# EAGLE design lcmxo256c_bb (EAGLE 7.3.0)
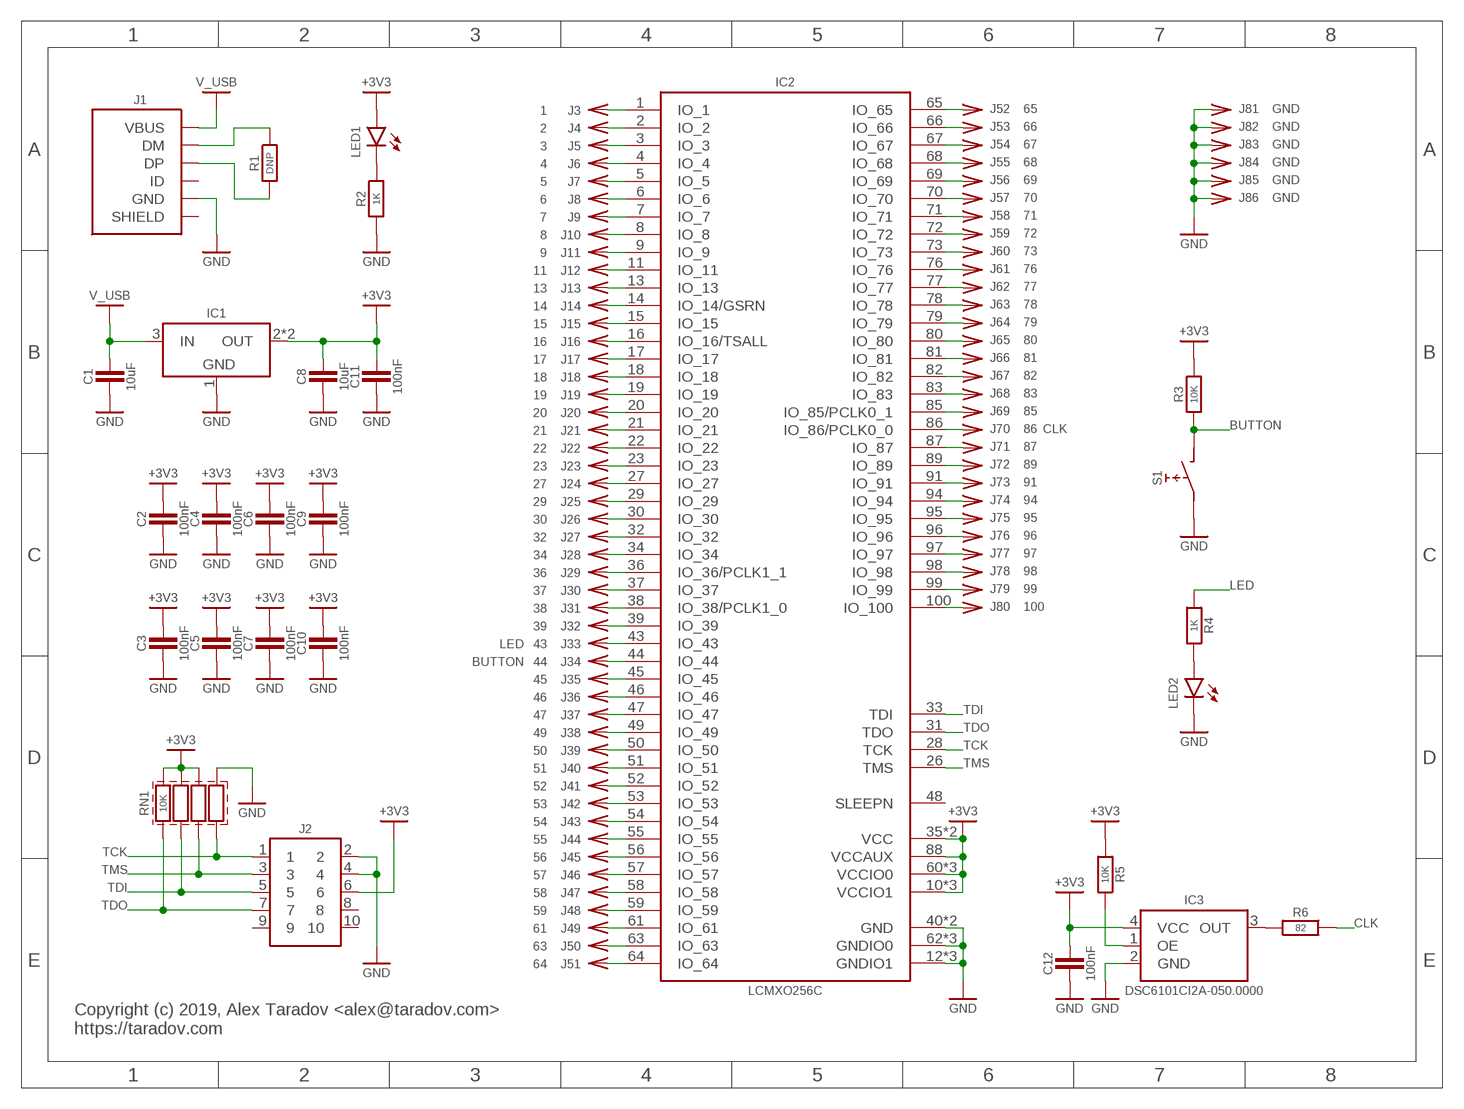
[diagram p0: schematic, sheet 1]

## Parts
C1  10uF  C-0805  [SMD0805]
C2  100nF  C-0603  [SMD0603]
C3  100nF  C-0603  [SMD0603]
C4  100nF  C-0603  [SMD0603]
C5  100nF  C-0603  [SMD0603]
C6  100nF  C-0603  [SMD0603]
C7  100nF  C-0603  [SMD0603]
C8  10uF  C-0805  [SMD0805]
C9  100nF  C-0603  [SMD0603]
C10  100nF  C-0603  [SMD0603]
C11  100nF  C-0603  [SMD0603]
C12  100nF  C-0603  [SMD0603]
IC1  LM1117-SOT223  [SOT223]
IC2  LCMXO256C  LCMXO256C-100  [TQFP-100-0.5MM]
IC3  DSC6101CI2A-050.0000  OSC_EN-CDFN4  [CDFN4]
J1  USB-B-MICRO-SMT  [USB-B-MICRO-SMT-SHELL-TH]
J2  HEADER-5X2-TH-1.27  [HEADER-5X2-1.27MM]
J3  1  CONN-SINGLE-TH  [PIN-TH]
J4  2  CONN-SINGLE-TH  [PIN-TH]
J5  3  CONN-SINGLE-TH  [PIN-TH]
J6  4  CONN-SINGLE-TH  [PIN-TH]
J7  5  CONN-SINGLE-TH  [PIN-TH]
J8  6  CONN-SINGLE-TH  [PIN-TH]
J9  7  CONN-SINGLE-TH  [PIN-TH]
J10  8  CONN-SINGLE-TH  [PIN-TH]
J11  9  CONN-SINGLE-TH  [PIN-TH]
J12  11  CONN-SINGLE-TH  [PIN-TH]
J13  13  CONN-SINGLE-TH  [PIN-TH]
J14  14  CONN-SINGLE-TH  [PIN-TH]
J15  15  CONN-SINGLE-TH  [PIN-TH]
J16  16  CONN-SINGLE-TH  [PIN-TH]
J17  17  CONN-SINGLE-TH  [PIN-TH]
J18  18  CONN-SINGLE-TH  [PIN-TH]
J19  19  CONN-SINGLE-TH  [PIN-TH]
J20  20  CONN-SINGLE-TH  [PIN-TH]
J21  21  CONN-SINGLE-TH  [PIN-TH]
J22  22  CONN-SINGLE-TH  [PIN-TH]
J23  23  CONN-SINGLE-TH  [PIN-TH]
J24  27  CONN-SINGLE-TH  [PIN-TH]
J25  29  CONN-SINGLE-TH  [PIN-TH]
J26  30  CONN-SINGLE-TH  [PIN-TH]
J27  32  CONN-SINGLE-TH  [PIN-TH]
J28  34  CONN-SINGLE-TH  [PIN-TH]
J29  36  CONN-SINGLE-TH  [PIN-TH]
J30  37  CONN-SINGLE-TH  [PIN-TH]
J31  38  CONN-SINGLE-TH  [PIN-TH]
J32  39  CONN-SINGLE-TH  [PIN-TH]
J33  43  CONN-SINGLE-TH  [PIN-TH]
J34  44  CONN-SINGLE-TH  [PIN-TH]
J35  45  CONN-SINGLE-TH  [PIN-TH]
J36  46  CONN-SINGLE-TH  [PIN-TH]
J37  47  CONN-SINGLE-TH  [PIN-TH]
J38  49  CONN-SINGLE-TH  [PIN-TH]
J39  50  CONN-SINGLE-TH  [PIN-TH]
J40  51  CONN-SINGLE-TH  [PIN-TH]
J41  52  CONN-SINGLE-TH  [PIN-TH]
J42  53  CONN-SINGLE-TH  [PIN-TH]
J43  54  CONN-SINGLE-TH  [PIN-TH]
J44  55  CONN-SINGLE-TH  [PIN-TH]
J45  56  CONN-SINGLE-TH  [PIN-TH]
J46  57  CONN-SINGLE-TH  [PIN-TH]
J47  58  CONN-SINGLE-TH  [PIN-TH]
J48  59  CONN-SINGLE-TH  [PIN-TH]
J49  61  CONN-SINGLE-TH  [PIN-TH]
J50  63  CONN-SINGLE-TH  [PIN-TH]
J51  64  CONN-SINGLE-TH  [PIN-TH]
J52  65  CONN-SINGLE-TH  [PIN-TH]
J53  66  CONN-SINGLE-TH  [PIN-TH]
J54  67  CONN-SINGLE-TH  [PIN-TH]
J55  68  CONN-SINGLE-TH  [PIN-TH]
J56  69  CONN-SINGLE-TH  [PIN-TH]
J57  70  CONN-SINGLE-TH  [PIN-TH]
J58  71  CONN-SINGLE-TH  [PIN-TH]
J59  72  CONN-SINGLE-TH  [PIN-TH]
J60  73  CONN-SINGLE-TH  [PIN-TH]
J61  76  CONN-SINGLE-TH  [PIN-TH]
J62  77  CONN-SINGLE-TH  [PIN-TH]
J63  78  CONN-SINGLE-TH  [PIN-TH]
J64  79  CONN-SINGLE-TH  [PIN-TH]
J65  80  CONN-SINGLE-TH  [PIN-TH]
J66  81  CONN-SINGLE-TH  [PIN-TH]
J67  82  CONN-SINGLE-TH  [PIN-TH]
J68  83  CONN-SINGLE-TH  [PIN-TH]
J69  85  CONN-SINGLE-TH  [PIN-TH]
J70  86  CONN-SINGLE-TH  [PIN-TH]
J71  87  CONN-SINGLE-TH  [PIN-TH]
J72  89  CONN-SINGLE-TH  [PIN-TH]
J73  91  CONN-SINGLE-TH  [PIN-TH]
J74  94  CONN-SINGLE-TH  [PIN-TH]
J75  95  CONN-SINGLE-TH  [PIN-TH]
J76  96  CONN-SINGLE-TH  [PIN-TH]
J77  97  CONN-SINGLE-TH  [PIN-TH]
J78  98  CONN-SINGLE-TH  [PIN-TH]
J79  99  CONN-SINGLE-TH  [PIN-TH]
J80  100  CONN-SINGLE-TH  [PIN-TH]
J81  GND  CONN-SINGLE-TH  [PIN-TH]
J82  GND  CONN-SINGLE-TH  [PIN-TH]
J83  GND  CONN-SINGLE-TH  [PIN-TH]
J84  GND  CONN-SINGLE-TH  [PIN-TH]
J85  GND  CONN-SINGLE-TH  [PIN-TH]
J86  GND  CONN-SINGLE-TH  [PIN-TH]
LED1  LED_SMDLED_0603  [SMD0603]
LED2  LED_SMDLED_0603  [SMD0603]
R1  DNP  R-0603  [SMD0603]
R2  1K  R-0603  [SMD0603]
R3  10K  R-0603  [SMD0603]
R4  1K  R-0603  [SMD0603]
R5  10K  R-0603  [SMD0603]
R6  82  R-0603  [SMD0603]
RN1  10K  RN-4-0603-X4  [SMD0603-X4]
S1  TACT_SWITCH_6MM-SMD-HALF  [TACT-SMD-6MM-HALF]

## Nets
+3V3: C2.2 C3.2 C4.2 C5.2 C6.2 C7.2 C8.2 C9.2 C10.2 C11.2 C12.2 IC1.2(OUT) IC1.4(OUT) IC2.10(VCCIO1) IC2.24(VCCIO1) IC2.35(VCC) IC2.41(VCCIO1) IC2.60(VCCIO0) IC2.74(VCCIO0) IC2.88(VCCAUX) IC2.90(VCC) IC2.92(VCCIO0) IC3.4(VCC) J2.6 LED1.1(A) R3.2 R5.1 RN1.6 RN1.7 RN1.8
BUTTON: IC2.44(IO_44) J34.1 R3.1 S1.2
CLK: IC2.86(IO_86/PCLK0_0) J70.1 R6.2
GND: C1.1 C2.1 C3.1 C4.1 C5.1 C6.1 C7.1 C8.1 C9.1 C10.1 C11.1 C12.1 IC1.1(GND) IC2.12(GNDIO1) IC2.25(GNDIO1) IC2.40(GND) IC2.42(GNDIO1) IC2.62(GNDIO0) IC2.75(GNDIO0) IC2.84(GND) IC2.93(GNDIO0) IC3.2(GND) J1.5(GND) J2.2 J2.4 J81.1 J82.1 J83.1 J84.1 J85.1 J86.1 LED2.2(C) R2.1 RN1.5 S1.1
LED: IC2.43(IO_43) J33.1 R4.1
N$1: IC2.1(IO_1) J3.1
N$2: IC2.2(IO_2) J4.1
N$3: IC2.3(IO_3) J5.1
N$4: J1.2(DM) R1.2
N$5: IC2.4(IO_4) J6.1
N$6: J1.3(DP) R1.1
N$7: IC2.5(IO_5) J7.1
N$9: IC2.6(IO_6) J8.1
N$10: IC2.7(IO_7) J9.1
N$12: IC2.8(IO_8) J10.1
N$13: IC2.9(IO_9) J11.1
N$14: IC2.11(IO_11) J12.1
N$15: IC2.13(IO_13) J13.1
N$16: IC2.14(IO_14/GSRN) J14.1
N$17: IC2.15(IO_15) J15.1
N$18: IC2.16(IO_16/TSALL) J16.1
N$19: IC2.17(IO_17) J17.1
N$20: IC2.18(IO_18) J18.1
N$21: IC2.19(IO_19) J19.1
N$22: IC2.20(IO_20) J20.1
N$23: IC2.21(IO_21) J21.1
N$24: IC2.22(IO_22) J22.1
N$25: IC2.23(IO_23) J23.1
N$26: IC2.27(IO_27) J24.1
N$27: IC2.29(IO_29) J25.1
N$28: IC2.30(IO_30) J26.1
N$29: IC2.32(IO_32) J27.1
N$30: IC2.34(IO_34) J28.1
N$31: IC2.36(IO_36/PCLK1_1) J29.1
N$32: IC2.37(IO_37) J30.1
N$33: IC2.38(IO_38/PCLK1_0) J31.1
N$34: IC2.39(IO_39) J32.1
N$35: IC3.3(OUT) R6.1
N$36: IC3.1(OE) R5.2
N$37: IC2.45(IO_45) J35.1
N$38: IC2.46(IO_46) J36.1
N$39: IC2.47(IO_47) J37.1
N$40: IC2.49(IO_49) J38.1
N$41: IC2.50(IO_50) J39.1
N$42: IC2.51(IO_51) J40.1
N$43: IC2.52(IO_52) J41.1
N$44: IC2.53(IO_53) J42.1
N$45: IC2.54(IO_54) J43.1
N$46: IC2.55(IO_55) J44.1
N$47: IC2.56(IO_56) J45.1
N$48: IC2.57(IO_57) J46.1
N$49: IC2.58(IO_58) J47.1
N$50: IC2.59(IO_59) J48.1
N$51: IC2.67(IO_67) J54.1
N$52: IC2.61(IO_61) J49.1
N$53: IC2.68(IO_68) J55.1
N$54: LED2.1(A) R4.2
N$55: IC2.63(IO_63) J50.1
N$56: IC2.64(IO_64) J51.1
N$57: IC2.65(IO_65) J52.1
N$58: IC2.66(IO_66) J53.1
N$59: IC2.69(IO_69) J56.1
N$60: IC2.70(IO_70) J57.1
N$61: IC2.71(IO_71) J58.1
N$62: IC2.72(IO_72) J59.1
N$63: IC2.73(IO_73) J60.1
N$64: IC2.76(IO_76) J61.1
N$65: IC2.77(IO_77) J62.1
N$66: IC2.78(IO_78) J63.1
N$67: IC2.79(IO_79) J64.1
N$68: IC2.80(IO_80) J65.1
N$69: IC2.81(IO_81) J66.1
N$70: IC2.82(IO_82) J67.1
N$71: IC2.83(IO_83) J68.1
N$72: IC2.85(IO_85/PCLK0_1) J69.1
N$74: IC2.87(IO_87) J71.1
N$75: IC2.89(IO_89) J72.1
N$76: IC2.91(IO_91) J73.1
N$77: IC2.94(IO_94) J74.1
N$78: IC2.95(IO_95) J75.1
N$79: IC2.96(IO_96) J76.1
N$80: IC2.97(IO_97) J77.1
N$81: IC2.98(IO_98) J78.1
N$82: IC2.99(IO_99) J79.1
N$83: IC2.100(IO_100) J80.1
N$84: LED1.2(C) R2.2
TCK: IC2.28(TCK) J2.1 RN1.4
TDI: IC2.33(TDI) J2.5 RN1.2
TDO: IC2.31(TDO) J2.7 RN1.1
TMS: IC2.26(TMS) J2.3 RN1.3
V_USB: C1.2 IC1.3(IN) J1.1(VBUS)
Unconnected: IC2.48(SLEEPN) J1.4(ID) J1.M1(SHIELD) J1.M2(SHIELD) J1.M3(SHIELD) J1.M4(SHIELD) J2.8 J2.9 J2.10

## Notes on the sheet
- Copyright (c) 2019, Alex Taradov <alex@taradov.com>
  https://taradov.com

## Library data of the parts
C1-C12 = ataradov_rlc:C
IC1 = ataradov_vreg:LM1117: LM1117 voltage regulator
IC2 = ataradov_pld:LCMXO256C-100
IC3 = ataradov_crystal:OSC_EN: Generic oscillator with output enable
J1 = ataradov_conn:USB-B-MICRO
J2 = ataradov_conn:HEADER-5X2
J3-J86 = ataradov_conn:CONN-SINGLE
LED1 LED2 = ataradov_led:LED_SMD: SMD_LED
R1-R6 = ataradov_rlc:R
RN1 = ataradov_rlc:RN-4
S1 = ataradov_switch:TACT_SWITCH_6MM

## Board
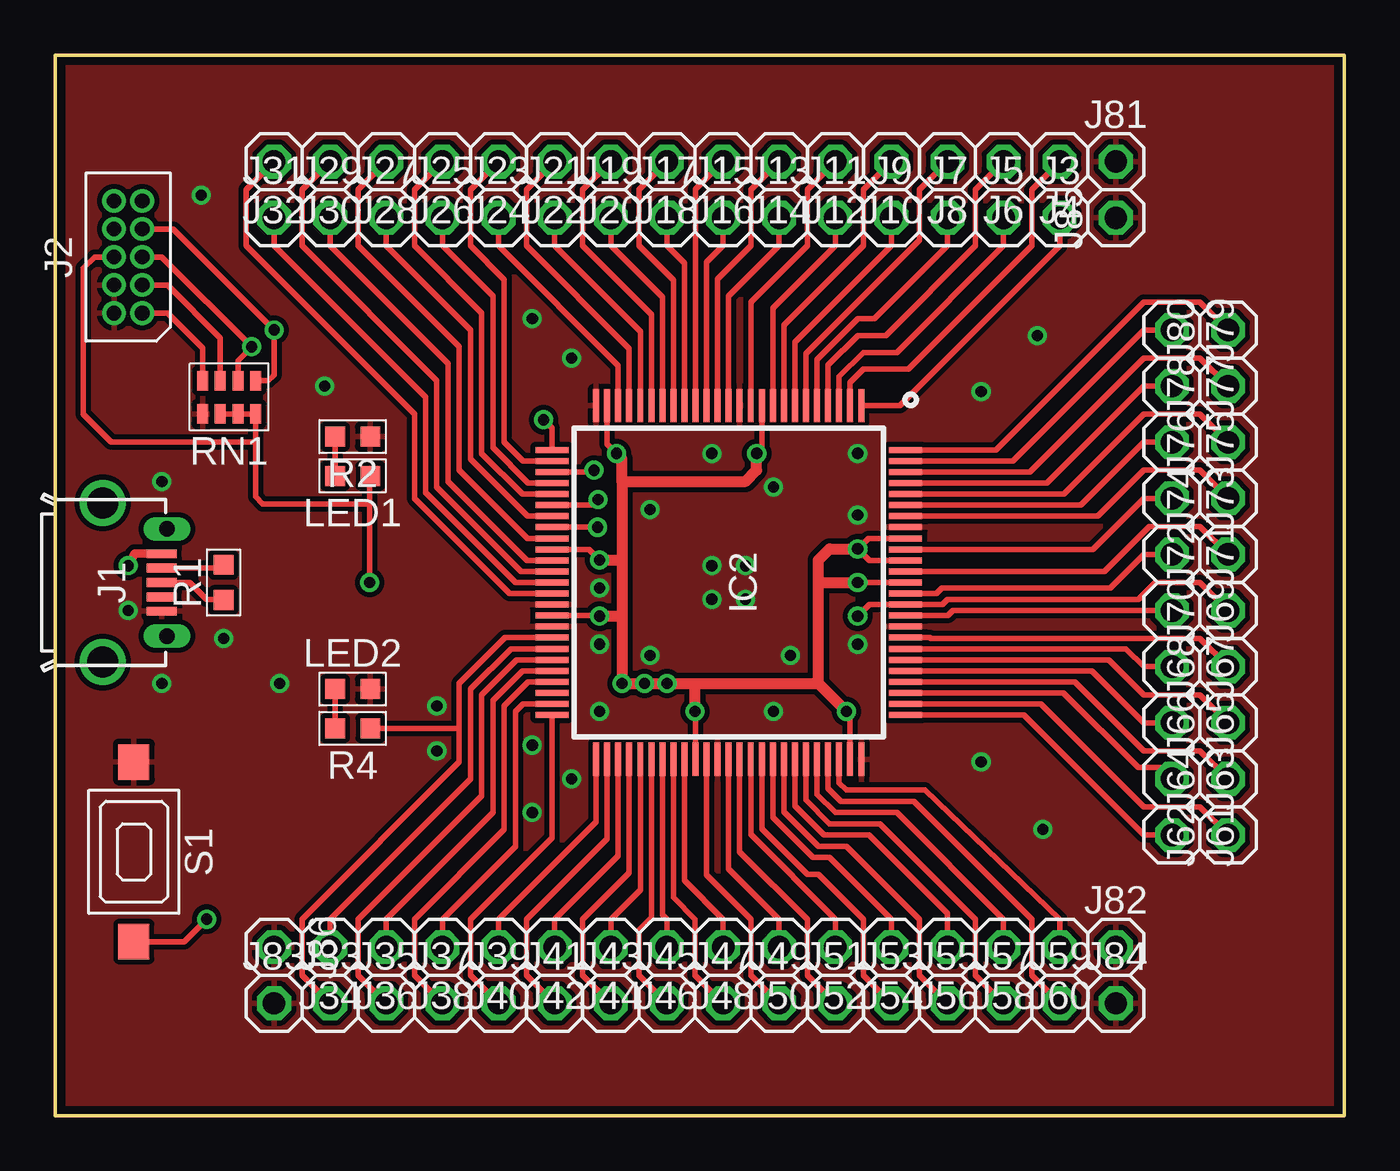
[diagram p1: board, top side]
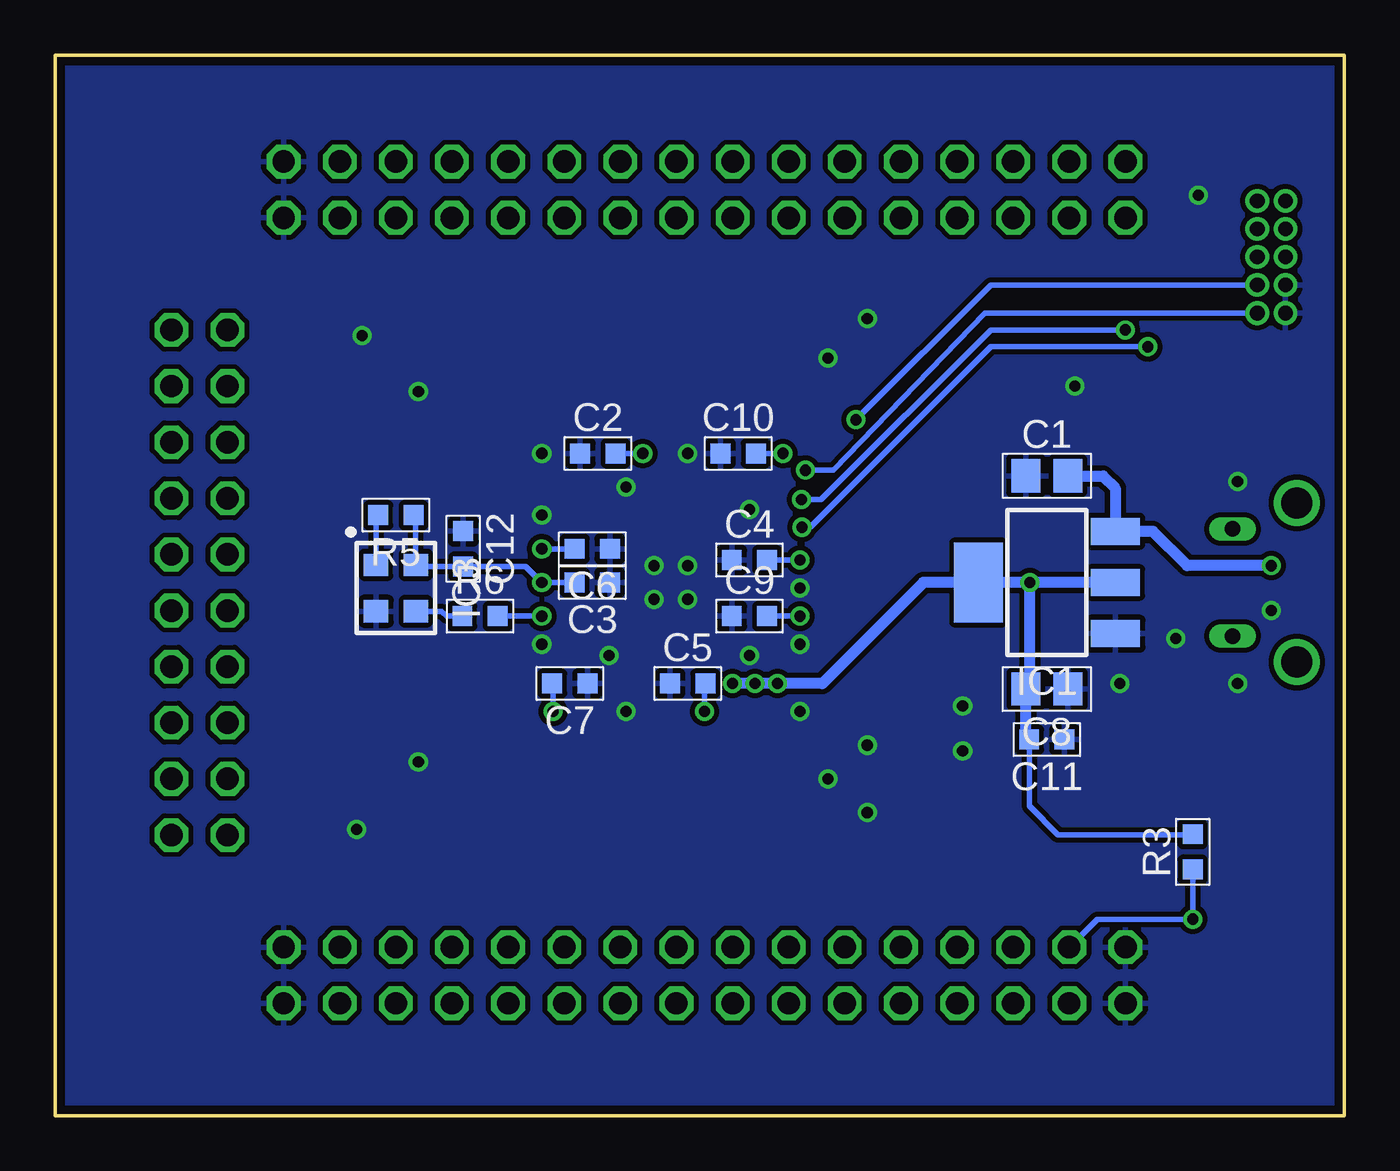
[diagram p2: board, bottom side, seen from below]

Size 58.34 x 48 mm. Coordinates in mm from the lower left corner, seen from the top.
Outline: 0,0 58.34,0 58.34,48 0,48 0,0
Copper layers (1*16): Top 0.0356mm / dielectric 1.5011mm / Bottom 0.0356mm
Design rules "std-tented": minimum track width 6mil, minimum drill 13mil, track to track 6mil, track to pad 6mil, pad to pad 6mil, via to via 6mil, smd to smd 6mil, copper to edge 15mil, drill to drill 6mil, minimum pad ring 7mil, minimum via ring 7mil, stop-mask expansion 3mil, vias tented up to drill 25mil, thermal gap 10mil

### Footprints (pad centres in the part's own frame; a part is rotated, then mirrored left to right if it is on the bottom)
SMD0805 = smd 1.3 x 1.5: 1 -0.95,0; 2 0.95,0
SMD0603 = smd 0.9 x 0.9: 1 -0.8,0; 2 0.8,0
SOT223 = smd 1.219 x 2.235: 1 -2.311,-3.099; 2 0,-3.099; 3 2.311,-3.099 | smd 3.6 x 2.2: 4 0,3.099
TQFP-100-0.5MM = smd 1.5 x 0.27: 1 -8,6; 2 -8,5.5; 3 -8,5; 4 -8,4.5; 5 -8,4; 6 -8,3.5; 7 -8,3; 8 -8,2.5; 9 -8,2; 10 -8,1.5; 11 -8,1; 12 -8,0.5; 13 -8,0; 14 -8,-0.5; 15 -8,-1; 16 -8,-1.5; 17 -8,-2; 18 -8,-2.5; 19 -8,-3; 20 -8,-3.5; 21 -8,-4; 22 -8,-4.5; 23 -8,-5; 24 -8,-5.5; 25 -8,-6; 51 8,-6; 52 8,-5.5; 53 8,-5; 54 8,-4.5; 55 8,-4; 56 8,-3.5; 57 8,-3; 58 8,-2.5; 59 8,-2; 60 8,-1.5; 61 8,-1; 62 8,-0.5; 63 8,0; 64 8,0.5; 65 8,1; 66 8,1.5; 67 8,2; 68 8,2.5; 69 8,3; 70 8,3.5; 71 8,4; 72 8,4.5; 73 8,5; 74 8,5.5; 75 8,6 | smd 0.27 x 1.5: 26 -6,-8; 27 -5.5,-8; 28 -5,-8; 29 -4.5,-8; 30 -4,-8; 31 -3.5,-8; 32 -3,-8; 33 -2.5,-8; 34 -2,-8; 35 -1.5,-8; 36 -1,-8; 37 -0.5,-8; 38 0,-8; 39 0.5,-8; 40 1,-8; 41 1.5,-8; 42 2,-8; 43 2.5,-8; 44 3,-8; 45 3.5,-8; 46 4,-8; 47 4.5,-8; 48 5,-8; 49 5.5,-8; 50 6,-8; 76 6,8; 77 5.5,8; 78 5,8; 79 4.5,8; 80 4,8; 81 3.5,8; 82 3,8; 83 2.5,8; 84 2,8; 85 1.5,8; 86 1,8; 87 0.5,8; 88 0,8; 89 -0.5,8; 90 -1,8; 91 -1.5,8; 92 -2,8; 93 -2.5,8; 94 -3,8; 95 -3.5,8; 96 -4,8; 97 -4.5,8; 98 -5,8; 99 -5.5,8; 100 -6,8
CDFN4 = smd 1 x 1.1: 1 -1.05,-0.9; 2 1.05,-0.9; 3 1.05,0.9; 4 -1.05,0.9
USB-B-MICRO-SMT-SHELL-TH = smd 1.35 x 0.4: 1 4.825,1.3; 2 4.825,0.65; 3 4.825,0; 4 4.825,-0.65; 5 4.825,-1.3 | drill 1.397: M1 2.15,-3.6; M2 2.15,3.6 | drill 0.7 long: M3 5.05,2.425; M4 5.05,-2.425
HEADER-5X2-1.27MM = drill 0.66 pad 1.067: 1 -2.54,-0.635; 2 -2.54,0.635; 3 -1.27,-0.635; 4 -1.27,0.635; 5 0,-0.635; 6 0,0.635; 7 1.27,-0.635; 8 1.27,0.635; 9 2.54,-0.635; 10 2.54,0.635
PIN-TH = drill 1.016 octagon: 1 0,0
SMD0603-X4 = smd 0.5 x 0.889: 1 -1.2,-0.752; 2 -0.4,-0.752; 3 0.4,-0.752; 4 1.2,-0.752; 5 1.2,0.752; 6 0.4,0.752; 7 -0.4,0.752; 8 -1.2,0.752
TACT-SMD-6MM-HALF = smd 1.6 x 1.4: 1 -4.064,0; 2 4.064,0

### Placement (x,y rotation side)
C1  13.46,28.96 0 bottom
C2  33.78,29.97 0 bottom
C3  34.04,24.13 180 bottom
C4  26.92,25.15 0 bottom
C5  29.72,19.56 0 bottom
C6  34.04,25.65 180 bottom
C7  35.05,19.56 180 bottom
C8  13.46,19.3 180 bottom
C9  26.92,22.61 0 bottom
C10  27.43,29.97 0 bottom
C11  13.46,17.02 180 bottom
C12  39.88,25.65 270 bottom
IC1  13.46,24.13 90 bottom
IC2  30.48,24.13 270 top
IC3  42.93,23.88 270 bottom
J1  0,24.13 0 top
J2  3.3,38.86 90 top
J3  45.47,40.64 0 top
J4  45.47,43.18 180 top
J5  42.93,40.64 0 top
J6  42.93,43.18 180 top
J7  40.39,40.64 0 top
J8  40.39,43.18 180 top
J9  37.85,40.64 0 top
J10  37.85,43.18 180 top
J11  35.31,40.64 0 top
J12  35.31,43.18 180 top
J13  32.77,40.64 0 top
J14  32.77,43.18 180 top
J15  30.23,40.64 0 top
J16  30.23,43.18 180 top
J17  27.69,40.64 0 top
J18  27.69,43.18 180 top
J19  25.15,40.64 0 top
J20  25.15,43.18 180 top
J21  22.61,40.64 0 top
J22  22.61,43.18 180 top
J23  20.07,40.64 0 top
J24  20.07,43.18 180 top
J25  17.53,40.64 0 top
J26  17.53,43.18 180 top
J27  14.99,40.64 0 top
J28  14.99,43.18 180 top
J29  12.45,40.64 0 top
J30  12.45,43.18 180 top
J31  9.91,40.64 0 top
J32  9.91,43.18 180 top
J33  12.45,5.08 0 top
J34  12.45,7.62 180 top
J35  14.99,5.08 0 top
J36  14.99,7.62 180 top
J37  17.53,5.08 0 top
J38  17.53,7.62 180 top
J39  20.07,5.08 0 top
J40  20.07,7.62 180 top
J41  22.61,5.08 0 top
J42  22.61,7.62 180 top
J43  25.15,5.08 0 top
J44  25.15,7.62 180 top
J45  27.69,5.08 0 top
J46  27.69,7.62 180 top
J47  30.23,5.08 0 top
J48  30.23,7.62 180 top
J49  32.77,5.08 0 top
J50  32.77,7.62 180 top
J51  35.31,5.08 0 top
J52  35.31,7.62 180 top
J53  37.85,5.08 0 top
J54  37.85,7.62 180 top
J55  40.39,5.08 0 top
J56  40.39,7.62 180 top
J57  42.93,5.08 0 top
J58  42.93,7.62 180 top
J59  45.47,5.08 0 top
J60  45.47,7.62 180 top
J61  50.55,12.7 270 top
J62  53.09,12.7 90 top
J63  50.55,15.24 270 top
J64  53.09,15.24 90 top
J65  50.55,17.78 270 top
J66  53.09,17.78 90 top
J67  50.55,20.32 270 top
J68  53.09,20.32 90 top
J69  50.55,22.86 270 top
J70  53.09,22.86 90 top
J71  50.55,25.4 270 top
J72  53.09,25.4 90 top
J73  50.55,27.94 270 top
J74  53.09,27.94 90 top
J75  50.55,30.48 270 top
J76  53.09,30.48 90 top
J77  50.55,33.02 270 top
J78  53.09,33.02 90 top
J79  50.55,35.56 270 top
J80  53.09,35.56 90 top
J81  48.01,43.18 0 top
J82  48.01,7.62 0 top
J83  9.91,5.08 0 top
J84  48.01,5.08 0 top
J85  48.01,40.64 90 top
J86  9.91,7.62 270 top
LED1  13.46,28.96 180 top
LED2  13.46,19.3 0 top
R1  7.62,24.13 90 top
R2  13.46,30.73 180 top
R3  6.86,11.94 90 bottom
R4  13.46,17.53 180 top
R5  42.93,27.18 180 bottom
R6  39.12,22.61 0 bottom
RN1  7.87,32.51 180 top
S1  3.56,11.94 270 top

### Tracks (layer width: path | path; a pad name or v marks a point on that pad's centre or on a via)
+3V3  (via drill 0.51)
  Top 0.254: v25.4,29.97 24.98,30.39 IC2.24 | v31.75,29.97 31.98,30.2 IC2.10 | IC2.92 36.8,26.13 v36.32,25.65 36.85,25.13 IC2.90 | v36.32,24.13 IC2.88 | v28.96,18.29 28.98,18.26 IC2.60 | v35.81,18.29 35.98,18.12 IC2.74 | IC2.41 24.61,22.63 v24.64,22.61 | v24.64,25.15 24.15,25.63 IC2.35 | LED1.1 14.22,28.92 14.22,27.69 | 14.22,27.69 v14.22,24.13 | J2.6 1.78,38.86 1.27,38.35 1.27,31.75 2.54,30.48 9.07,30.48 | RN1.6 RN1.7 RN1.8 9.07,30.48 | 9.07,30.48 9.07,28.01 9.4,27.69 14.22,27.69
  Top 0.508: 25.65,28.7 31.24,28.7 31.75,29.21 v31.75,29.97 | 25.65,28.7 25.65,25.15 | 25.65,25.15 25.65,22.61 | 25.65,22.61 v25.65,19.56 28.96,19.56 | 28.96,19.56 34.54,19.56 | 34.54,19.56 34.54,24.13 | 34.54,24.13 34.54,25.15 35.05,25.65 v36.32,25.65 | 25.65,28.7 25.65,29.72 v25.4,29.97 | v24.64,25.15 25.65,25.15 | v24.64,22.61 25.65,22.61 | 34.54,24.13 v36.32,24.13 | v28.96,18.29 28.96,19.56 | 34.54,19.56 v35.81,18.29
  Bottom 0.254: C10.2 v25.4,29.97 | C2.2 v31.75,29.97 | C9.2 v24.64,22.61 | C4.2 v24.64,25.15 | C3.2 v36.32,24.13 37.05,24.85 C12.2 41.95,24.85 IC3.4 42.03,27.08 R5.1 | C6.2 v36.32,25.65 | C7.2 35.81,19.52 v35.81,18.29 | C5.2 28.96,19.52 v28.96,18.29 | R3.2 6.9,12.7 12.95,12.7 14.26,14.01 C11.2 14.41,17.17 | C8.2 14.22,19.49
  Bottom 0.508: IC1.2 v14.22,24.13 | v14.22,24.13 IC1.4 19.05,24.13 23.62,19.56 v25.65,19.56 v26.67,19.56 v27.69,19.56 | 14.41,17.17 C8.2 | 14.22,19.49 v14.22,24.13
BUTTON  (via drill 0.51)
  Top 0.254: J34.1 12.45,8.89 18.8,15.24 18.8,19.3 20.62,21.13 IC2.44 | v6.86,8.89 5.84,7.87 S1.2
  Bottom 0.254: J34.1 11.18,8.89 v6.86,8.89 R3.1
CLK  (via drill 0.51)
  Top 0.254: J70.1 51.82,24.13 49.78,24.13 49.02,23.37 40.39,23.37 40.15,23.13 IC2.86 36.85,23.13 v36.32,22.61
  Bottom 0.254: R6.2 v36.32,22.61
GND  (via drill 0.51 pad 0.25)
  other vias: 7.62,21.59 3.3,22.86 4.83,28.7 4.83,19.56 31.24,24.89 23.37,15.24 41.91,16 44.7,12.95 41.91,32.77 21.59,36.07 44.45,35.31 29.72,24.89 29.72,23.37 21.59,16.76 21.59,13.72 23.37,34.29 29.72,29.97 36.32,29.97 26.92,27.43 32.51,28.45 36.32,21.34 36.32,27.18 31.24,23.37 24.64,18.29 32.51,18.29 24.64,21.34 24.64,23.88 26.92,20.83 33.27,20.83 17.27,18.54 17.27,16.51 10.16,19.56 6.6,41.66 12.19,33.02
  pour Bottom (isolate 0.229): 0,48.01 58.42,48.01 58.42,0 0,0
  pour Top (isolate 0.229): 0,48.01 58.42,48.01 58.42,0 0,0
LED
  Top 0.254: J33.1 11.18,6.35 11.18,8.89 18.29,16 18.29,17.53 | 18.29,17.53 18.29,19.56 20.36,21.63 IC2.43 | R4.1 18.29,17.53
N$1
  Top 0.254: J3.1 45.47,39.37 38.23,32.13 IC2.1
N$2
  Top 0.254: J4.1 44.2,41.91 44.2,39.37 38.61,33.78 36.58,33.78 35.98,33.19 IC2.2
N$3
  Top 0.254: IC2.3 35.48,33.45 36.58,34.54 38.1,34.54 42.93,39.37 J5.1
N$4
  Top 0.254: R1.2 7.47,24.78 J1.2
N$5
  Top 0.254: J6.1 41.66,41.91 41.66,39.37 37.59,35.31 36.32,35.31 34.98,33.96 IC2.4
N$6
  Top 0.254: R1.1 7.58,23.37 6.86,23.37 6.1,24.13 J1.3
N$7
  Top 0.254: J7.1 40.39,39.37 37.08,36.07 36.32,36.07 34.48,34.23 IC2.5
N$9
  Top 0.254: J8.1 39.12,41.91 39.12,39.62 33.98,34.49 IC2.6
N$10
  Top 0.254: J9.1 37.85,39.37 33.48,35 IC2.7
N$12
  Top 0.254: J10.1 36.58,41.91 36.58,39.37 32.98,35.77 IC2.8
N$13
  Top 0.254: J11.1 35.31,39.37 32.48,36.54 IC2.9
N$14
  Top 0.254: J12.1 34.04,41.91 34.04,39.37 31.48,36.81 IC2.11
N$15
  Top 0.254: J13.1 32.77,39.37 30.48,37.08 IC2.13
N$16
  Top 0.254: J14.1 31.5,41.91 31.5,39.37 29.98,37.85 IC2.14
N$17
  Top 0.254: J15.1 30.23,39.37 29.48,38.62 IC2.15
N$18
  Top 0.254: J16.1 28.98,41.93 IC2.16
N$19
  Top 0.254: J17.1 27.69,39.37 28.48,38.58 IC2.17
N$20
  Top 0.254: J18.1 26.42,41.91 26.42,39.37 27.98,37.81 IC2.18
N$21
  Top 0.254: J19.1 25.15,39.37 27.48,37.04 IC2.19
N$22
  Top 0.254: J20.1 23.88,41.91 23.88,39.37 26.98,36.27 IC2.20
N$23
  Top 0.254: J21.1 22.61,39.37 26.48,35.5 IC2.21
N$24
  Top 0.254: J22.1 21.34,41.91 21.34,39.37 25.98,34.73 IC2.22
N$25
  Top 0.254: J23.1 20.07,39.37 25.48,33.96 IC2.23
N$26
  Top 0.254: J24.1 18.8,41.91 18.8,39.37 20.32,37.85 20.32,30.48 21.17,29.63 IC2.27
N$27
  Top 0.254: J25.1 17.53,39.37 19.81,37.08 19.81,30.23 21.41,28.63 IC2.29
N$28
  Top 0.254: J26.1 16.26,41.91 16.26,39.37 19.3,36.32 19.3,29.97 21.15,28.13 IC2.30
N$29
  Top 0.254: J27.1 14.99,39.37 18.8,35.56 18.8,29.72 21.38,27.13 IC2.32
N$30
  Top 0.254: J28.1 13.72,41.91 13.72,39.37 18.29,34.8 18.29,29.21 21.37,26.13 IC2.34
N$31
  Top 0.254: J29.1 12.45,39.37 17.78,34.04 17.78,28.7 21.35,25.13 IC2.36
N$32
  Top 0.254: J30.1 11.18,41.91 11.18,39.37 17.27,33.27 17.27,28.45 21.09,24.63 IC2.37
N$33
  Top 0.254: J31.1 9.91,39.37 16.76,32.51 16.76,28.19 20.83,24.13 IC2.38
N$34
  Top 0.254: J32.1 8.64,41.91 8.64,39.37 16.26,31.75 16.26,27.94 20.57,23.63 IC2.39
N$35
  Bottom 0.254: R6.1 40.64,22.61 40.86,22.83 IC3.3
N$36
  Bottom 0.254: R5.2 43.83,27.08 IC3.1
N$37
  Top 0.254: J35.1 13.72,6.35 13.72,8.89 19.3,14.48 19.3,19.05 20.88,20.63 IC2.45
N$38
  Top 0.254: J36.1 14.99,8.89 19.81,13.72 19.81,18.8 21.15,20.13 IC2.46
N$39
  Top 0.254: J37.1 16.26,6.35 16.26,8.89 20.32,12.95 20.32,18.54 21.41,19.63 IC2.47
N$40
  Top 0.254: J38.1 17.53,8.89 20.83,12.19 20.83,18.29 21.17,18.63 IC2.49
N$41
  Top 0.254: J39.1 18.8,6.35 18.8,8.89 22.48,12.57 IC2.50
N$42
  Top 0.254: J40.1 20.07,8.89 24.48,13.3 IC2.51
N$43
  Top 0.254: J41.1 21.34,6.35 21.34,8.89 24.98,12.53 IC2.52
N$44
  Top 0.254: J42.1 22.61,8.89 25.48,11.76 IC2.53
N$45
  Top 0.254: J43.1 23.88,6.35 23.88,8.89 25.98,10.99 IC2.54
N$46
  Top 0.254: J44.1 25.15,8.89 26.48,10.22 IC2.55
N$47
  Top 0.254: J45.1 26.42,6.35 26.42,8.38 26.98,8.95 IC2.56
N$48
  Top 0.254: J46.1 27.69,8.89 27.48,9.1 IC2.57
N$49
  Top 0.254: J47.1 28.96,6.35 28.96,8.89 27.98,9.87 IC2.58
N$50
  Top 0.254: J48.1 30.23,8.89 28.48,10.64 IC2.59
N$51
  Top 0.254: J54.1 37.85,8.89 35.05,11.68 34.29,11.68 32.48,13.49 IC2.67
N$52
  Top 0.254: J49.1 31.5,6.35 31.5,8.89 29.48,10.91 IC2.61
N$53
  Top 0.254: J55.1 39.12,6.35 39.12,8.89 35.81,12.19 34.54,12.19 32.98,13.76 IC2.68
N$54
  Top 0.254: LED2.1 R4.2
N$55
  Top 0.254: J50.1 32.77,8.89 30.48,11.18 IC2.63
N$56
  Top 0.254: J51.1 34.04,6.35 34.04,8.89 30.98,11.95 IC2.64
N$57
  Top 0.254: J52.1 35.31,8.89 31.48,12.72 IC2.65
N$58
  Top 0.254: J53.1 36.58,6.35 36.58,8.89 34.54,10.92 34.04,10.92 31.98,12.98 IC2.66
N$59
  Top 0.254: J56.1 40.39,9.14 36.83,12.7 34.8,12.7 33.48,14.02 IC2.69
N$60
  Top 0.254: J57.1 41.66,6.35 41.66,8.89 37.34,13.21 35.05,13.21 33.98,14.28 IC2.70
N$61
  Top 0.254: J58.1 42.93,8.89 38.1,13.72 35.31,13.72 34.48,14.54 IC2.71
N$62
  Top 0.254: J59.1 44.2,6.35 44.2,8.89 38.86,14.22 35.56,14.22 34.98,14.8 IC2.72
N$63
  Top 0.254: J60.1 45.47,8.89 39.37,14.73 35.81,14.73 35.48,15.07 IC2.73
N$64
  Top 0.254: J61.1 49.28,12.7 43.85,18.13 IC2.76
N$65
  Top 0.254: J62.1 51.82,13.97 49.28,13.97 44.62,18.63 IC2.77
N$66
  Top 0.254: J63.1 50.04,15.75 49.02,15.75 45.64,19.13 IC2.78
N$67
  Top 0.254: J64.1 51.82,16.51 49.28,16.51 46.16,19.63 IC2.79
N$68
  Top 0.254: J65.1 49.28,17.78 46.93,20.13 IC2.80
N$69
  Top 0.254: J66.1 51.82,19.05 49.28,19.05 47.7,20.63 IC2.81
N$70
  Top 0.254: J67.1 49.28,20.32 48.47,21.13 IC2.82
N$71
  Top 0.254: J68.1 51.82,21.59 39.62,21.59 39.58,21.63 IC2.83
N$72
  Top 0.254: J69.1 40.64,22.86 40.41,22.63 IC2.85
N$74
  Top 0.254: J71.1 49.28,25.4 47.75,23.88 40.13,23.88 39.89,23.63 IC2.87
N$75
  Top 0.254: J72.1 51.82,26.67 49.53,26.67 47.49,24.63 IC2.89
N$76
  Top 0.254: J73.1 49.28,27.94 46.97,25.63 IC2.91
N$77
  Top 0.254: J74.1 51.82,29.21 49.28,29.21 47.2,27.13 IC2.94
N$78
  Top 0.254: J75.1 49.28,30.48 46.43,27.63 IC2.95
N$79
  Top 0.254: J76.1 51.82,31.75 49.28,31.75 45.66,28.13 IC2.96
N$80
  Top 0.254: J77.1 49.28,33.02 44.89,28.63 IC2.97
N$81
  Top 0.254: J78.1 51.82,34.29 49.28,34.29 44.12,29.13 IC2.98
N$82
  Top 0.254: J79.1 49.28,35.56 43.35,29.63 IC2.99
N$83
  Top 0.254: J80.1 51.82,36.83 49.28,36.83 42.58,30.13 IC2.100
N$84
  Top 0.254: R2.2 LED1.2
TCK  (via drill 0.51)
  Top 0.254: v24.38,29.21 24.21,29.13 IC2.28 | J2.1 5.08,36.32 6.67,34.73 RN1.4
  Bottom 0.254: v24.38,29.21 23.11,29.21 16.26,36.32 J2.1
TDI  (via drill 0.51)
  Top 0.254: v24.55,26.63 IC2.33 | J2.5 4.83,38.86 v8.89,34.8 8.27,34.18 RN1.2
  Bottom 0.254: v24.55,26.63 24.17,26.63 16,34.8 v8.89,34.8
TDO  (via drill 0.51)
  Top 0.254: v24.57,27.88 24.31,27.63 IC2.31 | J2.7 5.33,40.13 v9.91,35.56 9.91,33.53 9.64,33.26 RN1.1
  Bottom 0.254: v24.57,27.88 23.68,27.88 16,35.56 v9.91,35.56
TMS  (via drill 0.51)
  Top 0.254: v22.1,31.5 22.48,31.11 IC2.26 | J2.3 5.08,37.59 7.47,35.2 RN1.3
  Bottom 0.254: v22.1,31.5 16,37.59 J2.3
V_USB  (via drill 0.51)
  Top 0.381: v3.3,24.89 3.59,25.43 J1.1
  Bottom 0.508: v3.3,24.89 7.11,24.89 8.66,26.44 IC1.3 10.36,28.4 10.92,28.96 C1.2

### Text on the board
tValues: AT | 12/29/19 | LCMXO256C | www.taradov.com